# EAGLE schematic schematic (EAGLE 9.4.1)
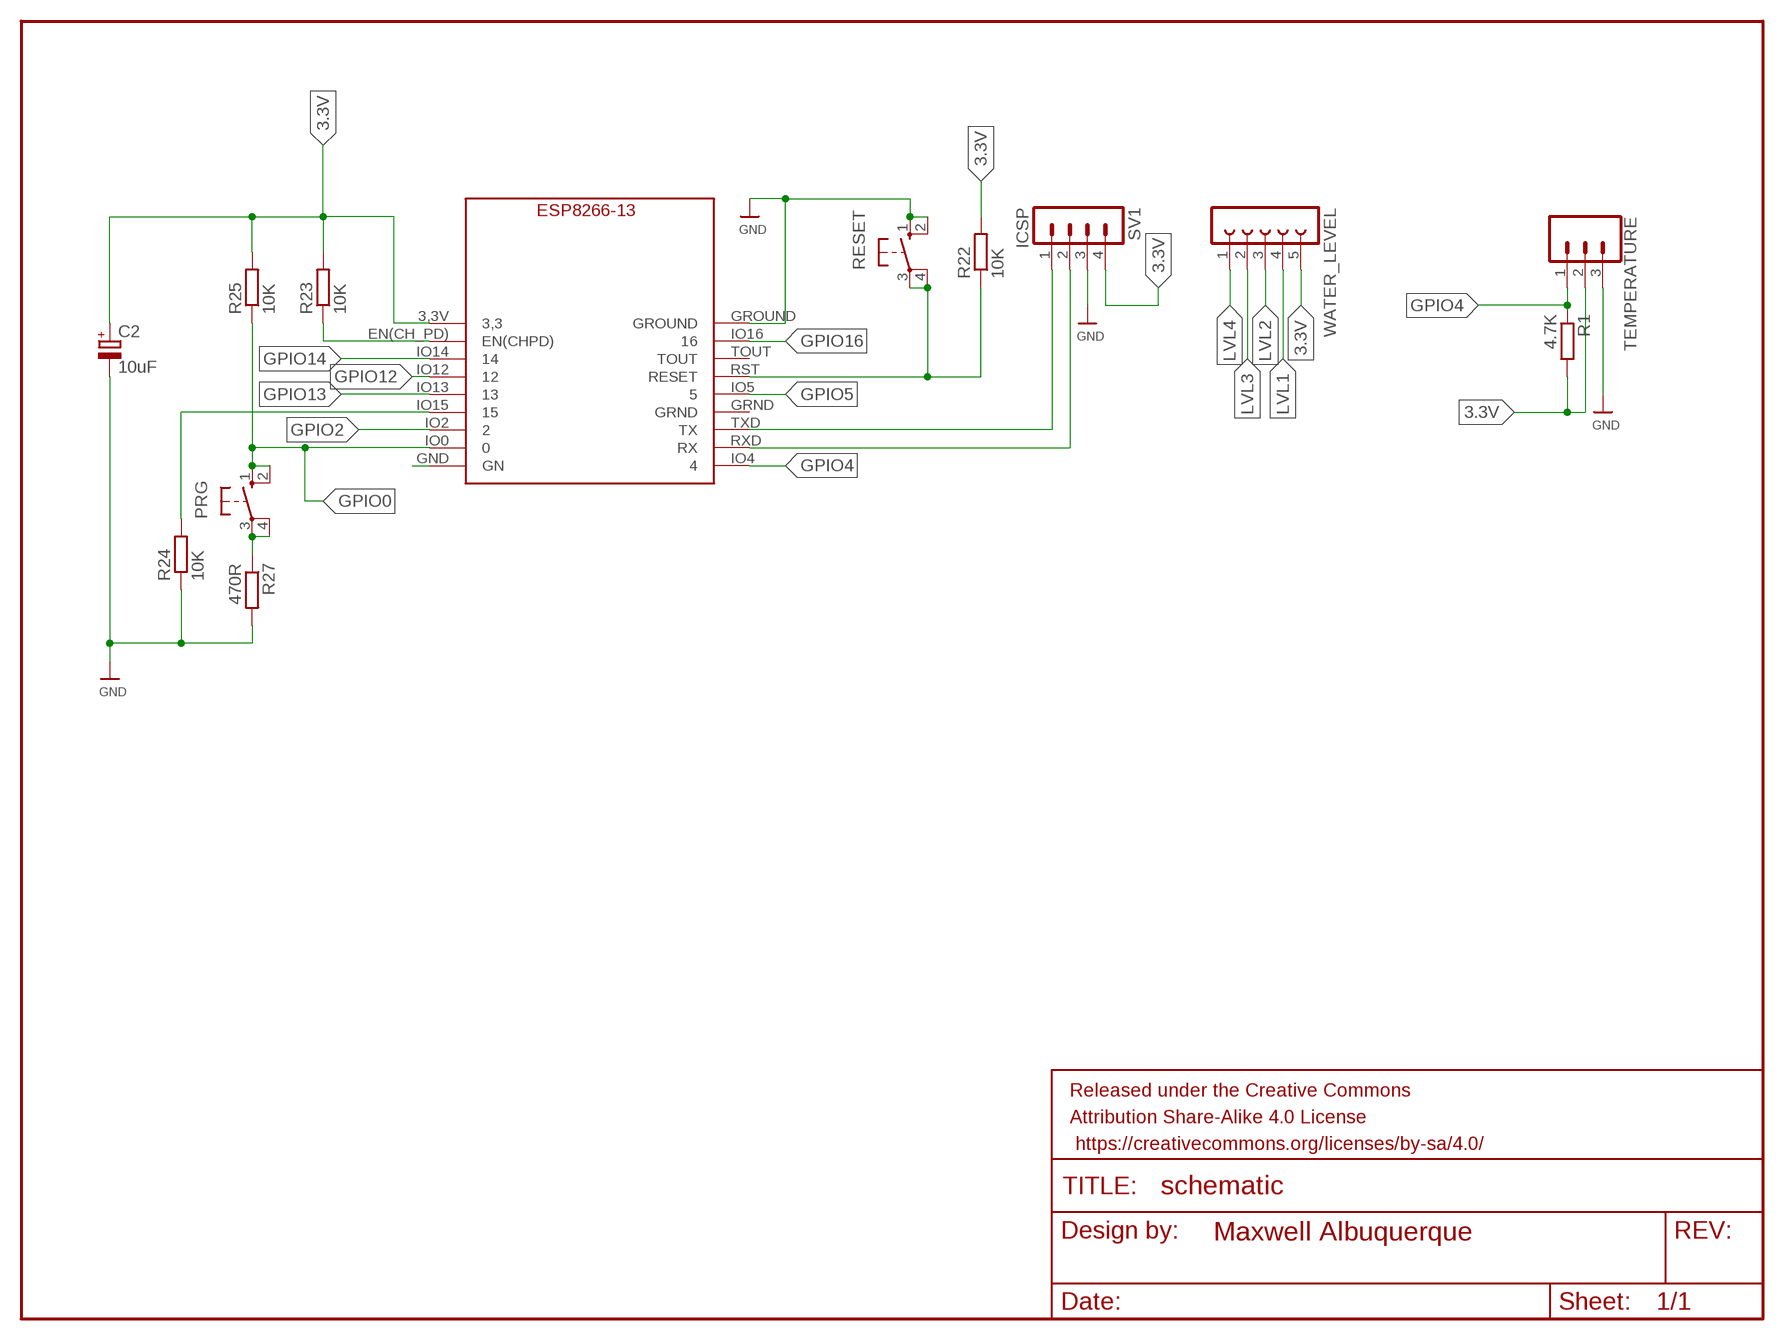
[diagram p0: schematic, sheet 1]

## Parts
C2  10uF  CPOL-EUE2.5-6  [E2,5-6]
FRAME2  FRAME-LETTER  [CREATIVE_COMMONS]
PRG  10-XX  [B3F-10XX]
R1  4.7K  R-EU_0207/10  [0207/10]
R22  10K  R-EU_0207/10  [0207/10]
R23  10K  R-EU_0207/10  [0207/10]
R24  10K  R-EU_0207/10  [0207/10]
R25  10K  R-EU_0207/10  [0207/10]
R27  470R  R-EU_0207/10  [0207/10]
RESET  10-XX  [B3F-10XX]
SV1  ICSP  MA04-1  [MA04-1]
TEMPERATURE  CONN_03  [1X03]
U$1  ESP8266-13  [ESP8266-13]
WATER_LEVEL  FE05-1  [FE05-1]

## Nets
3.3V: C2.+ R1.2 R22.2 R23.2 R25.2 SV1.4 TEMPERATURE.2 U$1.3,3V(3,3) WATER_LEVEL.5
GND: C2.- R24.1 R27.2 RESET.1(S) RESET.2(S1) SV1.3 TEMPERATURE.3 U$1.GROUND
GPIO0: PRG.1(S) PRG.2(S1) R25.1 U$1.IO0
GPIO2: U$1.IO2
GPIO4: R1.1 TEMPERATURE.1 U$1.IO4
GPIO5: U$1.IO5
GPIO12: U$1.IO12
GPIO13: U$1.IO13
GPIO14: U$1.IO14
GPIO15: R24.2 U$1.IO15
GPIO16: U$1.IO16
LVL1: WATER_LEVEL.4
LVL2: WATER_LEVEL.3
LVL3: WATER_LEVEL.2
LVL4: WATER_LEVEL.1
N$12: SV1.1 U$1.TXD(TX)
N$13: SV1.2 U$1.RXD(RX)
N$14: U$1.GND(GN)
N$15: PRG.3(P) PRG.4(P1) R27.1
N$16: R22.1 RESET.3(P) RESET.4(P1) U$1.RST(RESET)
N$17: R23.1 U$1.EN(CH_PD)(EN(CHPD))
Unconnected: U$1.GRND U$1.TOUT

## Library data of the parts
C2 = rcl:CPOL-EU: POLARIZED CAPACITOR, European symbol; SPICEPREFIX: C
FRAME2 = SparkFun-Aesthetics:FRAME-LETTER: Schematic Frame - Letter Standard 8.5x11 US Letter frame; DESIGNER: Maxwell Albuquerque
PRG RESET = switch-omron:10-XX: OMRON SWITCH; MPN: B3F-1000; OC_FARNELL: 176432; OC_NEWARK: 36M3542
R1 R22-R25 R27 = rcl:R-EU_: RESISTOR, European symbol; SPICEPREFIX: 4700R
SV1 = con-lstb:MA04-1: PIN HEADER; OC_FARNELL: unknown; OC_NEWARK: unknown
TEMPERATURE = SparkFun-Connectors:CONN_03: Multi connection point. Often used as Generic Header-pin footprint for 0.1 inch spaced/style header connections On any of the 0.1 inch spaced packages, you can populate with these: Break Away Headers - Straight <https://www.sparkfun.com/products/116> (PRT-00116) Break Away Male Headers - Right Angle <https://www.sparkfun.com/products/553> (PRT-00553) Female Headers <https://www.sparkfun.com/products/115> (PRT-00115) Break Away Headers - Machine Pin <https://www.sparkfun.com/products/117> (PRT-00117) Break Away Female Headers - Swiss Machine Pin <https://www.sparkfun.com/products/743> (PRT-00743) Stackable Header - 3 Pin (Female, 0.1") <https://www.sparkfun.com/products/13875> (PRT-13875) For SCREWTERMINALS and SPRING TERMINALS visit here: Screw Terimnals on SparkFun.com <https://www.sparkfun.com/search/results?term=Screw+Terminals> (5mm/3.5mm/2.54mm spacing) This device is also useful as a general connection point to wire up your design to another part of your project. Our various solder wires solder well into these plated through hole pads. Hook-Up Wire - Assortment (Stranded, 22 AWG) <https://www.sparkfun.com/products/11375> (PRT-11375) Hook-Up Wire - Assortment (Solid Core, 22 AWG) <https://www.sparkfun.com/products/11367> (PRT-11367) View the entire wire category on our website here <https://www.sparkfun.com/categories/141> Special notes: Molex polarized connector foot print use with SKU : PRT-08232 with associated crimp pins and housings.
U$1 = ESP8266-13:ESP8266-13: ESP8266-13
WATER_LEVEL = con-lsta:FE05-1: FEMALE HEADER; OC_FARNELL: unknown; OC_NEWARK: unknown